# EAGLE design grid-rfduino (EAGLE 6.5.0)
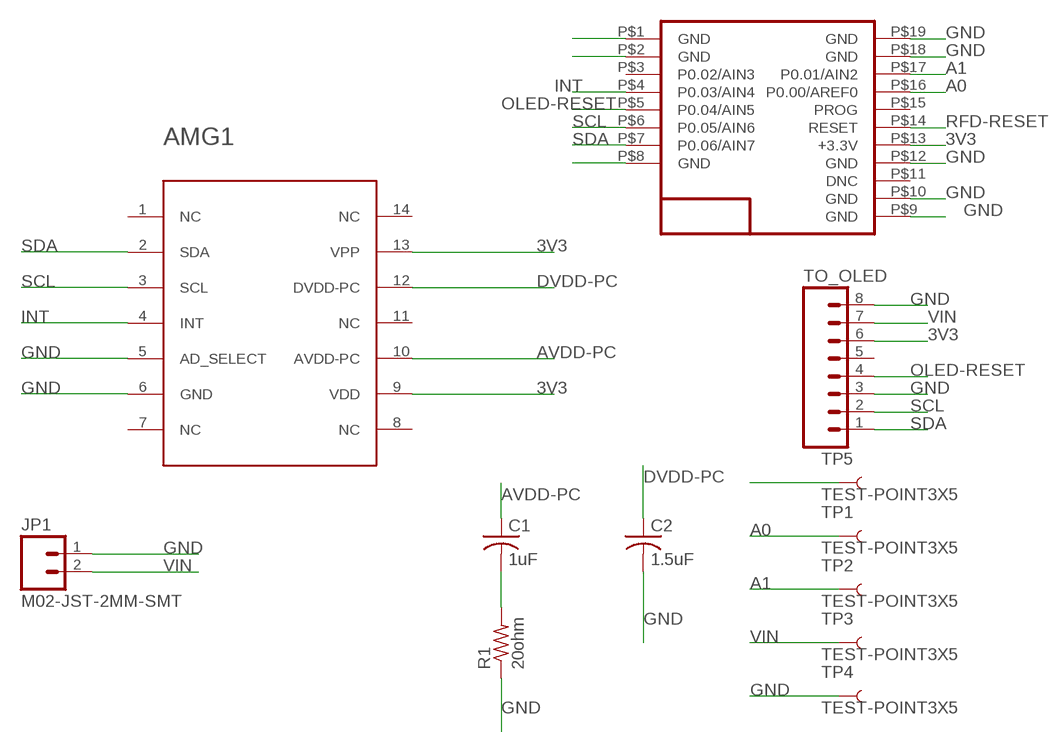
[diagram p0: schematic, sheet 1]

## Parts
AMG1  AMG8831  [AMG8831]
C1  1uF  C-USC0805  [C0805]
C2  1.5uF  C-USC0805  [C0805]
JP1  M02-JST-2MM-SMT  [JST-2-SMD]
R1  20ohm  R-US_M0805  [M0805]
TO_OLED  M08LOCK  [1X08_LOCK]
TP1  TEST-POINT3X5  [PAD.03X.05]
TP2  TEST-POINT3X5  [PAD.03X.05]
TP3  TEST-POINT3X5  [PAD.03X.05]
TP4  TEST-POINT3X5  [PAD.03X.05]
TP5  TEST-POINT3X5  [PAD.03X.05]
U$1  RFD22301  [RFD21733]

## Nets
3V3: AMG1.9(VDD) AMG1.13(VPP) TO_OLED.6 U$1.P$13(+3.3V)
A0: TP1.P$1 U$1.P$16(P0.00/AREF0)
A1: TP2.P$1 U$1.P$17(P0.01/AIN2)
AVDD-PC: AMG1.10(AVDD-PC) C1.1
DVDD-PC: AMG1.12(DVDD-PC) C2.1
GND: AMG1.5(AD_SELECT) AMG1.6(GND) C2.2 JP1.1 R1.1 TO_OLED.3 TO_OLED.8 TP4.P$1 U$1.P$1(GND) U$1.P$2(GND) U$1.P$8(GND) U$1.P$9(GND) U$1.P$10(GND) U$1.P$12(GND) U$1.P$18(GND) U$1.P$19(GND)
INT: AMG1.4(INT) U$1.P$4(P0.03/AIN4)
N$1: C1.2 R1.2
OLED-RESET: TO_OLED.4 U$1.P$5(P0.04/AIN5)
RFD-RESET: TP5.P$1 U$1.P$14(RESET)
SCL: AMG1.3(SCL) TO_OLED.2 U$1.P$6(P0.05/AIN6)
SDA: AMG1.2(SDA) TO_OLED.1 U$1.P$7(P0.06/AIN7)
VIN: JP1.2 TO_OLED.7 TP3.P$1
Unconnected: AMG1.1(NC) AMG1.7(NC) AMG1.8(NC) AMG1.11(NC) AMG1.14(NC) TO_OLED.5 U$1.P$3(P0.02/AIN3) U$1.P$11(DNC) U$1.P$15(PROG)

## Library data of the parts
AMG1 = AKA_test:AMG8831: Infrared Array Sensor Grid-EYE (AMG88) High Precision Infrared Array Sensor based on Advanced MEMS Technology I2C interface This outline is good for all models AMG88-x-y x = 3 or 5, indicating supply voltage y = 1 or 2; 1 is high-gain, 2 is low-gain See the datasheet from Panasonic here <http://pewa.panasonic.com/assets/pcsd/catalog/grid-eye-catalog.pdf>
C1 C2 = adafruit:C-US: CAPACITOR, American symbol
JP1 = SparkFun-Connectors:M02: Standard 2-pin 0.1" header. Use with - straight break away headers ( PRT-00116) - right angle break away headers (PRT-00553) - swiss pins (PRT-00743) - machine pins (PRT-00117) - female headers (PRT-00115) Molex polarized connector foot print use with: PRT-08233 with associated crimp pins and housings. 2.54_SCREWTERM for use with PRT-10571. 3.5mm Screw Terminal footprints for PRT-08084 5mm Screw Terminal footprints for use with PRT-08433; PROD_ID: CONN-08352
R1 = adafruit:R-US_: RESISTOR, American symbol
TO_OLED = SparkFun-Connectors:M08: Header 8 Standard 8-pin 0.1" header. Use with straight break away headers (SKU : PRT-00116), right angle break away headers (PRT-00553), swiss pins (PRT-00743), machine pins (PRT-00117), and female headers (PRT-00115).
TP1-TP5 = SparkFun-Passives:TEST-POINT: Bare copper test points for troubleshooting or ICT
U$1 = RFD22301-11.25.13:RFD22301: RF Digital RFD22301

## Board
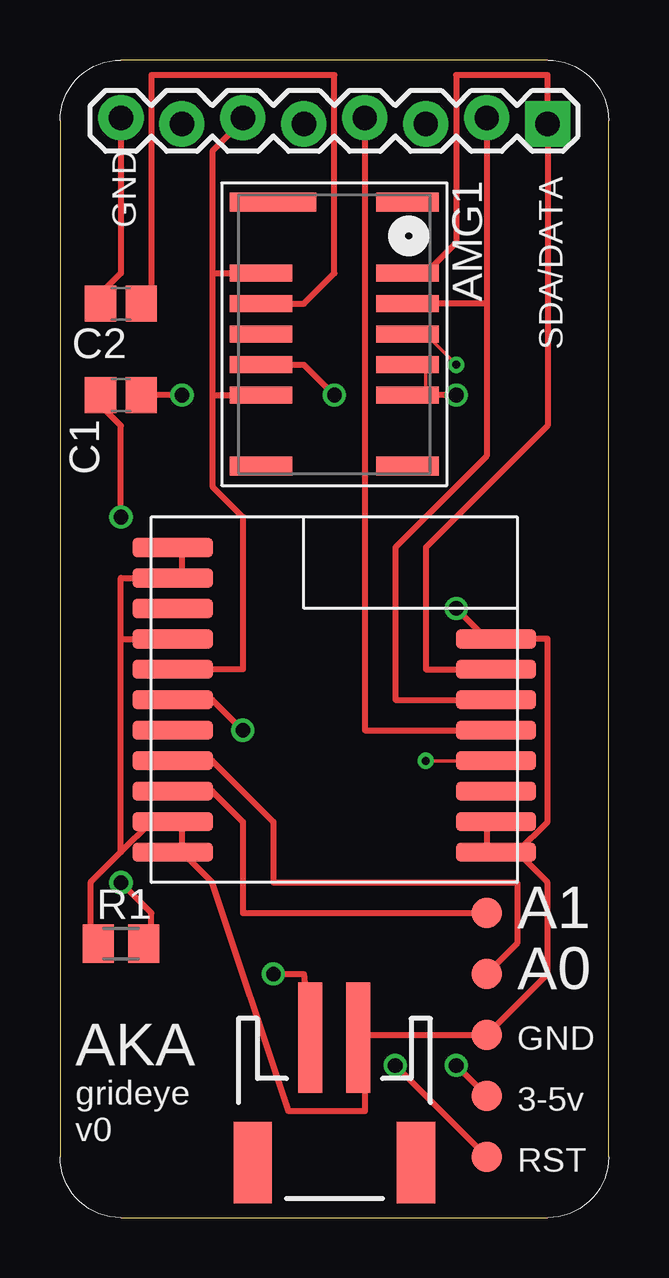
[diagram p1: board, top side]
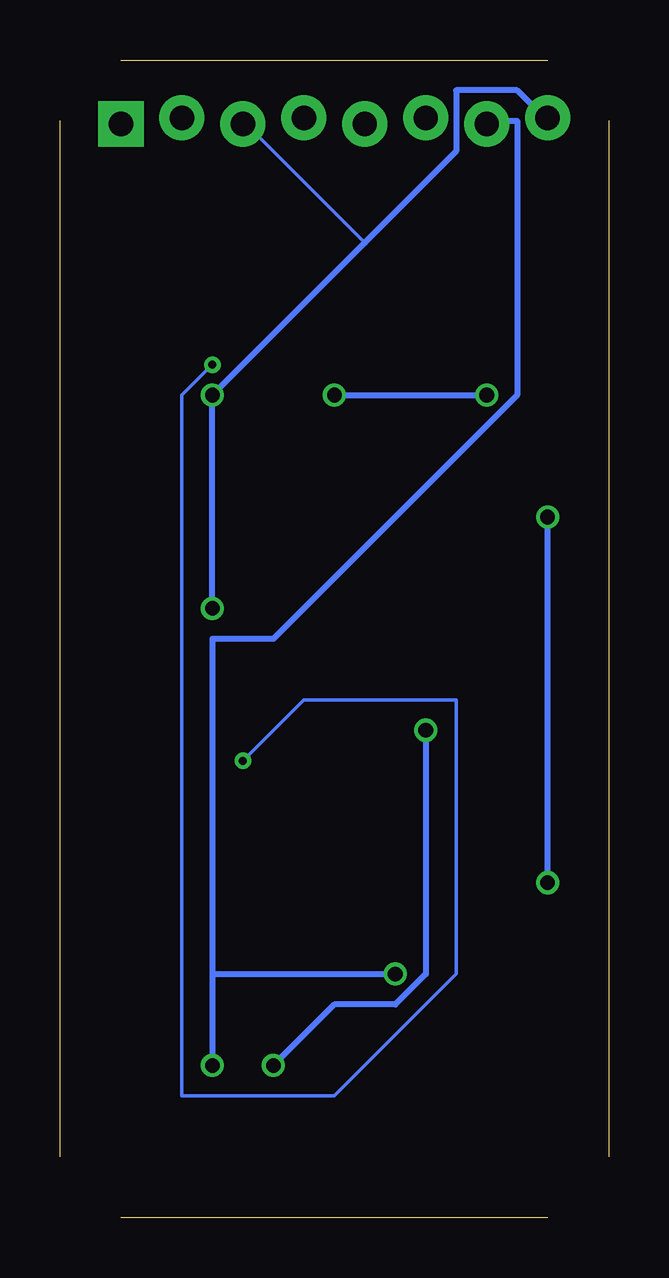
[diagram p2: board, bottom side, seen from below]

Size 22.86 x 48.26 mm. Coordinates in mm from the lower left corner, seen from the top.
Outline: 2.54,0 20.32,0
Outline: 22.86,2.54 22.86,45.72
Outline: 20.32,48.26 2.54,48.26
Outline: 0,45.72 0,2.54
Copper layers (1*16): Top 0.0356mm / dielectric 1.5011mm / Bottom 0.0356mm
Design rules "LaenPCBOrder": minimum track width 6mil, minimum drill 13mil, track to track 6mil, track to pad 6mil, pad to pad 6mil, via to via 6mil, smd to smd 6mil, copper to edge 15mil, drill to drill 6mil, minimum pad ring 7mil, minimum via ring 7mil, stop-mask expansion 3mil, vias tented up to drill 0mil, thermal gap 10mil

### Footprints (pad centres in the part's own frame; a part is rotated, then mirrored left to right if it is on the bottom)
AMG8831 = smd 0.8 x 2.6: 1 -5.5,3.05; 7 5.5,3.05; 8 5.5,-3.05 | smd 0.7 x 2.6: 2 -2.54,3.05; 3 -1.27,3.05; 4 0,3.05; 5 1.27,3.05; 6 2.54,3.05; 9 2.54,-3.05; 10 1.27,-3.05; 11 0,-3.05; 12 -1.27,-3.05; 13 -2.54,-3.05 | smd 0.8 x 3.6: 14 -5.5,-2.55
C0805 = smd 1.3 x 1.5: 1 -0.85,0; 2 0.85,0
JST-2-SMD = smd 1 x 4.6: 1 -1,-3.7; 2 1,-3.7 | smd 1.6 x 3.4: NC1 -3.4,1.5; NC2 3.4,1.5
M0805 = smd 1.3 x 1.6: 1 -0.95,0; 2 0.95,0
1X08_LOCK = drill 1.016 pad 1.88 square: 1 0,0.127 | drill 1.016 pad 1.88: 2 2.54,-0.127; 3 5.08,0.127; 4 7.62,-0.127; 5 10.16,0.127; 6 12.7,-0.127; 7 15.24,0.127; 8 17.78,-0.127
PAD.03X.05 = smd 1.27 x 1.27: P$1 0,0
RFD21733 = smd 3.353 x 0.813: P$1 -6.731,6.35; P$2 -6.731,5.08; P$3 -6.731,3.81; P$4 -6.731,2.54; P$5 -6.731,1.27; P$6 -6.731,0; P$7 -6.731,-1.27; P$8 -6.731,-2.54; P$9 6.731,-6.35; P$10 6.731,-5.08; P$11 6.731,-3.81; P$12 6.731,-2.54; P$13 6.731,-1.27; P$14 6.731,0; P$15 6.731,1.27; P$16 6.731,2.54; P$17 6.731,3.81; P$18 6.731,5.08; P$19 6.731,6.35

### Placement (x,y rotation side)
AMG1  11.43,36.83 270 top
C1  2.54,34.29 180 top
C2  2.54,38.1 180 top
JP1  11.43,3.81 180 top
R1  2.54,11.43 0 top
TO_OLED  20.32,45.72 180 top
TP1  17.78,10.16 0 top
TP2  17.78,12.7 0 top
TP3  17.78,5.08 0 top
TP4  17.78,7.62 0 top
TP5  17.78,2.54 0 top
U$1  11.43,21.59 180 top

### Tracks (layer width: path | path; a pad name or v marks a point on that pad's centre or on a via)
3V3
  Top 0.254: 6.35,34.29 AMG1.9 | 6.35,39.37 6.35,44.45 7.62,45.72 TO_OLED.6 | 6.35,39.37 6.35,34.29 | 6.35,39.37 AMG1.13 | U$1.P$13 7.62,22.86 7.62,29.21 6.35,30.48 6.35,34.29
A0
  Top 0.254: TP1.P$1 19.05,11.43 19.05,13.97 8.89,13.97 8.89,16.51 6.35,19.05 U$1.P$16
A1
  Top 0.254: TP2.P$1 7.62,12.7 7.62,16.51 6.35,17.78 U$1.P$17
AVDD-PC  (via drill 0.61)
  Top 0.254: v5.08,34.29 C1.1 | v11.43,34.29 10.16,35.56 AMG1.10
  Bottom 0.254: v11.43,34.29 v5.08,34.29
DVDD-PC
  Top 0.254: AMG1.12 10.16,38.1 11.43,39.37 11.43,47.62 3.81,47.62 3.81,38.1 C2.1
GND  (via drill 0.61)
  Top 0.152: 15.24,34.29 15.24,35.56 AMG1.5
  Top 0.254: U$1.P$2 17.78,16.51 17.78,15.24 U$1.P$1 19.05,15.24 | TO_OLED.8 2.54,39.37 1.27,38.1 C2.2 | v16.51,34.29 15.24,34.29 AMG1.6 | U$1.P$9 5.08,27.94 5.08,26.67 U$1.P$10 2.54,26.67 2.54,24.13 | 2.54,15.24 3.81,16.51 U$1.P$18 5.08,16.51 5.08,15.24 | 2.54,15.24 1.27,13.97 1.27,11.43 R1.1 | 2.54,24.13 U$1.P$12 | 2.54,15.24 2.54,24.13 | 19.05,15.24 20.32,16.51 20.32,24.13 U$1.P$8 17.78,24.13 v16.51,25.4 | 12.7,7.62 TP4.P$1 20.32,10.16 20.32,13.97 19.05,15.24 | 12.7,7.62 12.7,8.89 JP1.1 | 5.08,15.24 6.35,13.97 9.53,4.45 12.7,4.45 12.7,7.62 | 5.08,15.24 U$1.P$19
  Bottom 0.152: 10.16,40.64 15.24,45.72 TO_OLED.3
  Bottom 0.254: TO_OLED.8 2.54,45.72 3.81,46.99 6.35,46.99 6.35,44.45 10.16,40.64 v16.51,34.29 v16.51,25.4
INT  (via drill 0.33)
  Top 0.152: v16.51,35.56 15.24,36.83 AMG1.4 | U$1.P$4 v15.24,19.05
  Bottom 0.152: v16.51,35.56 17.78,34.29 17.78,5.08 11.43,5.08 6.35,10.16 6.35,21.59 12.7,21.59 v15.24,19.05
N$1  (via drill 0.61)
  Top 0.254: v2.54,29.21 2.54,33.02 1.27,34.29 C1.2 | v2.54,13.97 3.81,12.7 3.81,11.43 R1.2
  Bottom 0.254: v2.54,13.97 v2.54,29.21
OLED-RESET
  Top 0.254: U$1.P$5 12.7,20.32 TO_OLED.4
RFD-RESET  (via drill 0.61)
  Top 0.254: v13.97,6.35 TP5.P$1 | v7.62,20.32 6.35,21.59 U$1.P$14
  Bottom 0.254: v13.97,6.35 11.43,8.89 8.89,8.89 7.62,10.16 v7.62,20.32
SCL
  Top 0.254: 17.78,38.1 AMG1.3 | TO_OLED.2 17.78,38.1 | U$1.P$6 13.97,21.59 13.97,27.94 17.78,31.75 17.78,38.1
SDA
  Top 0.254: AMG1.2 15.24,39.37 16.51,40.64 16.51,47.62 20.32,47.62 TO_OLED.1 20.32,33.02 15.24,27.94 15.24,22.86 U$1.P$7
VIN  (via drill 0.61)
  Top 0.254: v16.51,6.35 TP3.P$1 | v8.89,10.16 10.16,10.16 JP1.2
  Bottom 0.254: 16.51,10.16 16.51,24.13 13.97,24.13 3.81,34.29 3.81,45.72 5.08,45.72 TO_OLED.7 | 16.51,10.16 v16.51,6.35 | 16.51,10.16 v8.89,10.16

### Text on the board
tNames: GND | SDA/DATA | A1 | A0 | GND | AKA | 3-5v | grideye / v0 | RST